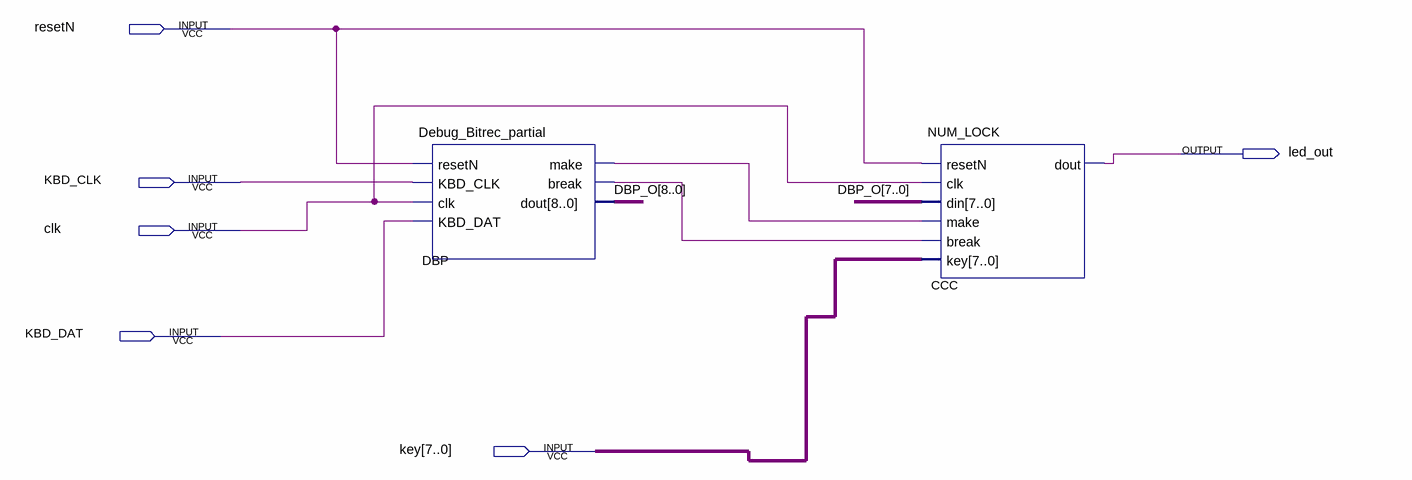
[diagram p0: schematic sheet]
// Quartus schematic KBDINTF.bdf as structural Verilog: 2 symbols, 6 pins
module KBDINTF (
  input  resetN,
  input  KBD_CLK,
  input  clk,
  input  KBD_DAT,
  input  [7:0] key,
  output led_out
);

  wire DBP_break, DBP_make;
  wire [8:0] DBP_O;

  Debug_Bitrec_partial DBP (
    .resetN(resetN), .KBD_CLK(KBD_CLK), .clk(clk), .KBD_DAT(KBD_DAT), .make(DBP_make), .\break (DBP_break),
    .dout(DBP_O));
  NUM_LOCK CCC (
    .resetN(resetN), .clk(clk), .din(DBP_O[7:0]), .make(DBP_make), .\break (DBP_break), .key(key),
    .dout(led_out));
endmodule
